# Altium schematic sheet Temperature_monitoring.SchDoc: =DocumentName
size A4; DocumentNumber: 1; Revision: 0; SheetNumber: 1; SheetTotal: 18; Last modified by: Maciej Przybysz
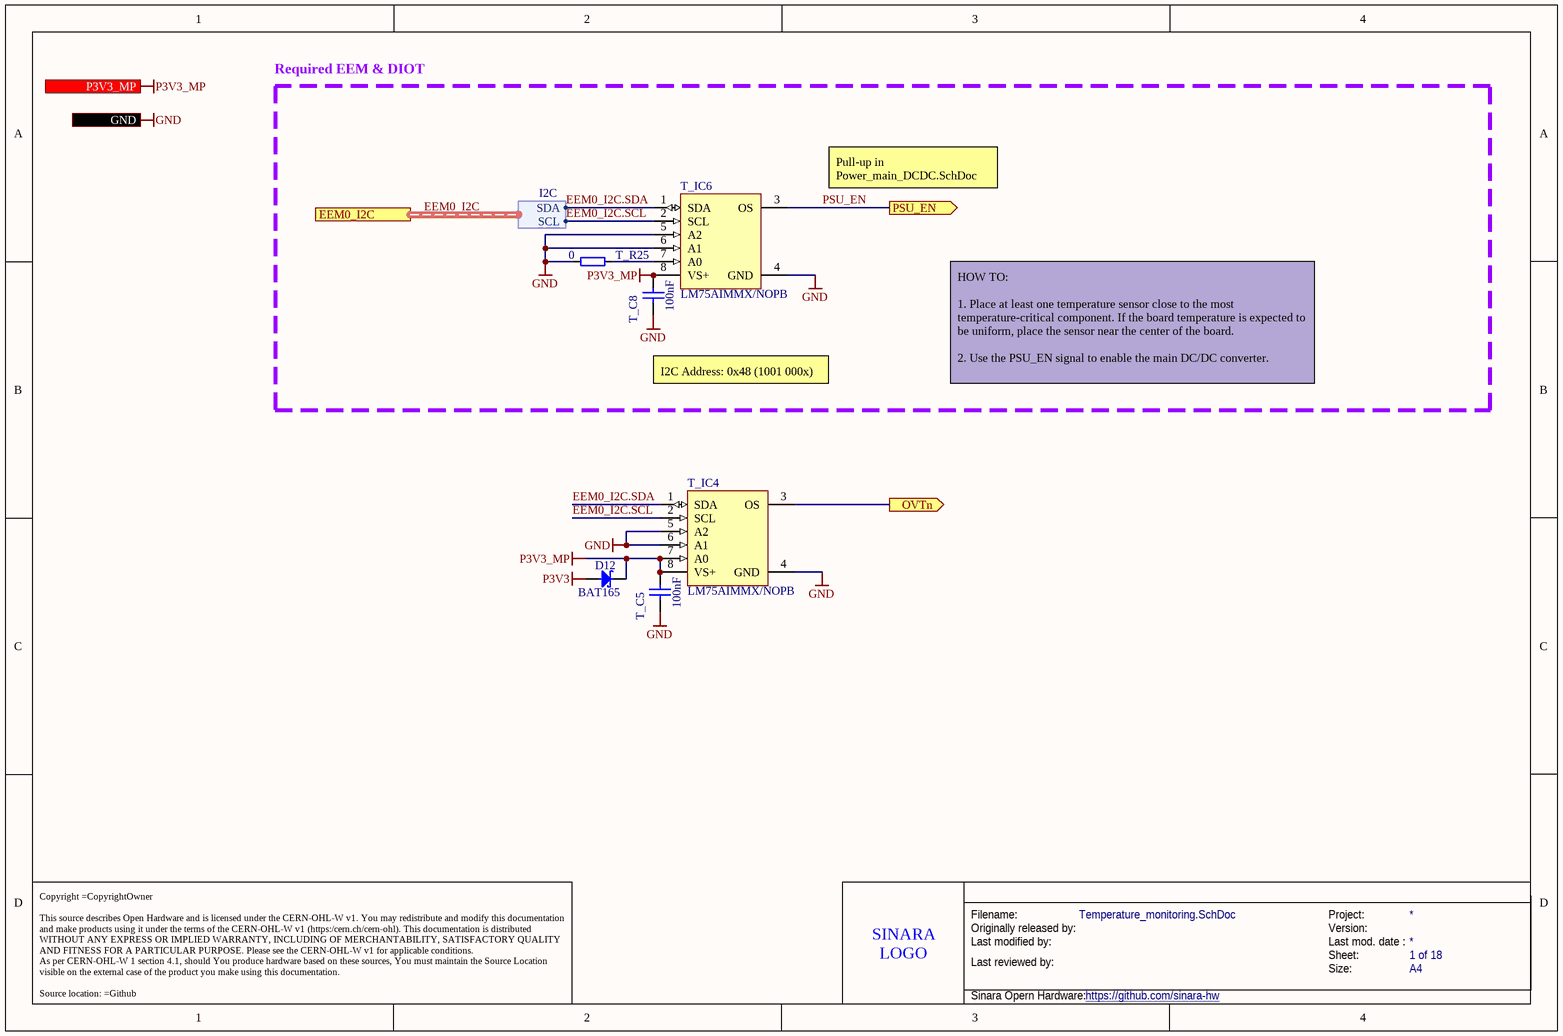
[diagram p0: Temperature_monitoring.SchDoc]

## Parts
D12  BAT165  [SOD2512X110N]
T_C5  100nF  [CAPC1005X55N]
T_C8  100nF  [CAPC1005X55N]
T_IC4  LM75AIMMX/NOPB  [DGK0008A_M]
T_IC6  LM75AIMMX/NOPB  [DGK0008A_M]
T_R25  0  [RESC1005X40N]

## Blocks framed on the sheet
Required EEM & DIOT: T_C8 T_IC6 T_R25

## Ports
EEM0_I2C (harness I2C), GND, OVTn (out), P3V3_MP (in), PSU_EN (out)

## Harnesses
I2C: SDA, SCL

## Nets
GND: T_C5.1 T_C8.1 T_IC4.4(GND) T_IC4.5(A2) T_IC4.6(A1) T_IC6.4(GND) T_IC6.5(A2) T_IC6.6(A1) T_R25.1 ; port GND
P3V3: D12.2(A)
P3V3_MP: D12.1(C) T_C5.2 T_C8.2 T_IC4.7(A0) T_IC4.8(VS+) T_IC6.8(VS+) ; port P3V3_MP
EEM0_I2C.SCL: T_IC4.2(SCL) T_IC6.2(SCL) ; port EEM0_I2C.SCL
EEM0_I2C.SDA: T_IC4.1(SDA) T_IC6.1(SDA) ; port EEM0_I2C.SDA
OVTn: T_IC4.3(OS) ; port OVTn
PSU_EN: T_IC6.3(OS) ; port PSU_EN
NetT_IC6_7: T_IC6.7(A0) T_R25.2

## Buses and harness runs
harness EEM0_I2C = port EEM0_I2C

## Notes on the sheet
- Pull-up in Power_main_DCDC.SchDoc
- I2C Address: 0x48 (1001 000x)
- HOW TO:
  1. Place at least one temperature sensor close to the most temperature-critical component. If the board temperature is expected to be uniform, place the sensor near the center of the board.
  2. Use the PSU_EN signal to enable the main DC/DC converter.
- Filename:
- Project:
- SINARA
  LOGO
  TBD
- Originally released by:
- Last modified by:
- Last reviewed by:
- Size:
- Version:
- Last mod. date :
- Sheet:
- A4
- Copyright =CopyrightOwner
  This source describes Open Hardware and is licensed under the CERN-OHL-W v1. You may redistribute and modify this documentation and make products using it under the terms of the CERN-OHL-W v1 (https:/cern.ch/cern-ohl). This documentation is distributed WITHOUT ANY EXPRESS OR IMPLIED WARRANTY, INCLUDING OF MERCHANTABILITY, SATISFACTORY QUALITY AND FITNESS FOR A PARTICULAR PURPOSE. Please see the CERN-OHL-W v1 for applicable conditions.
  As per CERN-OHL-W 1 section 4.1, should You produce hardware based on these sources, You must maintain the Source Location visible on the external case of the product you make using this documentation.
  Source location: =Github
- Sinara Opern Hardware:
- https://github.com/sinara-hw

## Library data of the parts
D12 = BAT165: Schottky Diode; Part Description: Medium Power AF Schottky Diode; Manufacturer: INFINEON; Voltage: 40V; Power: 750mA; PressFit: No; Bonding: No; Part Number: BAT165; Component Kind: Standard; Component Type: Standard; Device: BAT165; PackageDescription: Small Outline Diode Flat Lead (SOD-323), 1.70mm W X 1.25mm L X 1.10mm H body,  IPC Medium Density; Manufacturer Part Number: BAT165; Pin Count: 2; Case: SOD323; Mounted: Yes; Socket: No; SMD: Yes; Sense: No; ComponentHeight: 1.1mm; HelpURL: \\cern.ch\dfs\Applications\Altium\Datasheets\BAT165.pdf; Author: CERN DEM JLC; CreateDate: 12.11.2014; LatestRevisionDate: 12.11.2014
T_C5 T_C8 = CC0402_100NF_50V_10%_X7R: Non-polarised capacitor; Part Description: SMD Multilayer Chip Ceramic Capacitor; Manufacturer: GENERIC; Manufacturer1 Part Number: GRM155R71H104KE14D; Voltage: 50V; TC: X7R; Tolerance: ±10%; Part Number: CC0402_100NF_50V_10%_X7R; Component Kind: Standard; Component Type: Standard; Pin Count: 2; Value: 100nF; Status: None; Manufacturer Part Number: CC0402_100NF_50V_10%_X7R; Case: 0402; Mounted: Yes; Socket: No; SMD: Yes; Sense: No; Manufacturer1 Example: MURATA; Manufacturer1 ComponentHeight: 0.55mm; HelpURL: \\cern.ch\dfs\Applications\Altium\Datasheets\CC0402_MURATA_GRM155R71H104KE14D.pdf; Author: CERN DEM MR; CreateDate: 30.06.2017; LatestRevisionDate: 30.06.2017
T_IC4 T_IC6 = CMP-010-00652-2: Serial Switch/Digital Sensor, 9 Bit(s), 3Cel, Square, 8 Pin, Surface Mount; Min Supply Voltage: 2.7V; Max Supply Voltage: 5.5V; Sensor Type: TEMPERATURE SENSOR,SWITCH/DIGITAL OUTPUT,SERIAL; Max Operating Temperature: 125°C; Min Operating Temperature: -55°C; Pins: 8; RoHS Compliant: Yes; Mounting Technology: Surface Mount
T_R25 = R0402_0R_JUMPER: Resistor; Part Description: 1A (0.05R Max DC Resistance) Zero Ohm Jumper; Manufacturer: GENERIC; Manufacturer1 Part Number: 232270591001L; Part Number: R0402_0R_JUMPER; Component Kind: Standard; Component Type: Standard; Pin Count: 2; Value: 0; Status: Not recommended; Manufacturer Part Number: R0402_0R_JUMPER; Case: 0402; Mounted: Yes; Sense: No; Socket: No; SMD: Yes; Manufacturer1 Example: YAGEO PHYCOMP; Manufacturer1 ComponentHeight: 0.4mm; HelpURL: \\cern.ch\dfs\Applications\Altium\Datasheets\R0402_Phycomp_RC0402.pdf; Author: CERN DEM JLC; CreateDate: 03.12.2007; LatestRevisionDate: 17.10.2012